# Altium schematic sheet Photodiode.SchDoc
size 420 x 297 mm; Address1: Address1; Address2: Address2; Address3: Address3; Address4: Address4; DocumentNumber: *Э3; SheetNumber: 2; SheetTotal: 11; DocumentType: Схема электрическая *
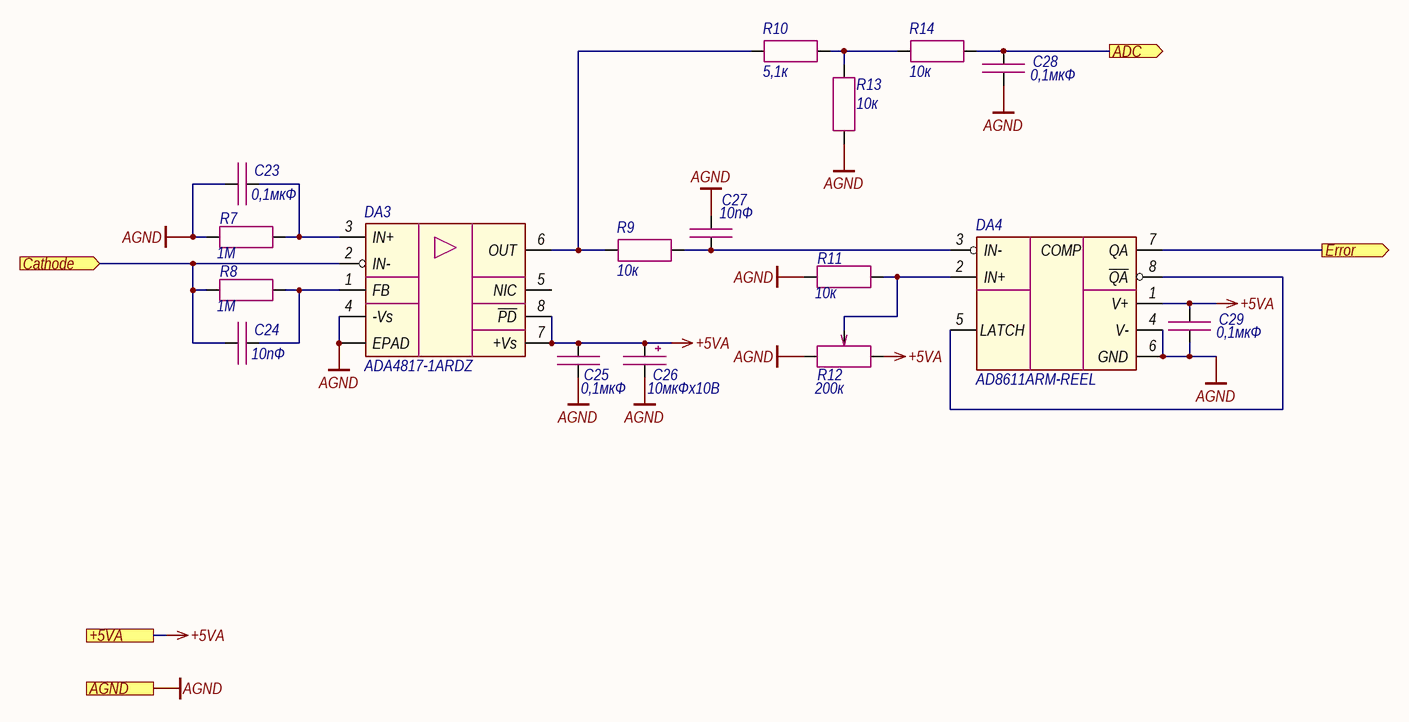
[diagram p0: Photodiode.SchDoc]

## Parts
C23  0,1мкФ  [CAP_0603]
C24  10пФ  [CAP_0603]
C25  0,1мкФ  [CAP_0603]
C26  10мкФх10B  [CAP_A]
C27  10пФ  [CAP_0603]
C28  0,1мкФ  [CAP_0603]
C29  0,1мкФ  [CAP_0603]
DA3  ADA4817-1ARDZ  [SOIC-8 EPAD]
DA4  AD8611ARM-REEL  [MSOP-8]
R7  1М  [RES_0805]
R8  1М  [RES_0805]
R9  10к  [RES_0603]
R10  5,1к  [RES_0603]
R11  10к  [RES_0603]
R12  200к  [3224W]
R13  10к  [RES_0603]
R14  10к  [RES_0603]

## Ports
+5VA (see Main[1A]), ADC (out, see Main[2A]), AGND (see Main[1A], Hardwiring[4D], LD_driver[2D], Thermistor[2C]), Cathode (in, see Main[1A]), Error (out, see Main[2A])

## Nets
+5VA: C25.1 C26.1 C29.1 DA3.7(+Vs) DA3.8(~{PD}) DA4.1(V+) R12.3 ; port +5VA
AGND: C23.1 C25.2 C26.2 C27.2 C28.2 C29.2 DA3.4(-Vs) DA3.EPAD DA4.4(V-) DA4.6(GND) R7.2 R11.1 R12.1 R13.2 ; port AGND
ADC: C28.1 R14.2 ; port ADC
Cathode: C24.2 DA3.2(IN-) R8.2 ; port Cathode
Error: DA4.7(QA) ; port Error
NetC23_2: C23.2 DA3.3(IN+) R7.1
NetC24_1: C24.1 DA3.1(FB) R8.1
NetC27_1: C27.1 DA4.3(IN-) R9.2
NetDA3_6: DA3.6(OUT) R9.1 R10.1
NetDA4_2: DA4.2(IN+) R11.2 R12.2
NetDA4_5: DA4.5(LATCH) DA4.8(~{QA})
NetR10_2: R10.2 R13.1 R14.1

Not connected (* = marked no-connect by the designer): DA3 5(NIC)

## Notes on the sheet
- Подп. и дата
- Инв. № дубл.
- Взам. инв. №
- Инв. № подл.
- Изм.
- Лист
- № докум.
- Подп.
- Дата
- Копировал
- Формат А3
- (in symbol AD8611) COMP

## Library data of the parts
C23 C25 C28 C29 = Capacitor: Manufacturer: Murata; Model: GRM188R71H104KA93D; Value: 0,1мкФ; Document: *
C24 C27 = Capacitor: Manufacturer: Murata; Model: GRM1885C1H100JA01D; Value: 10пФ; Document: *
C26 = Capacitor_Polar: Model: TECAP, 10 мкФ, 10 В, тип A, 10%; Value: 10мкФх10B; Document: *; Manufacturer: *
DA3 = ADA4817-1ARDZ: Manufacturer: Analog Devices; Model: ADA4817-1ARDZ; Document: *
DA4 = AD8611: Manufacturer: Analog Devices; Model: AD8611ARM-REEL; Document: *
R7 R8 = Resistor: Manufacturer: Yageo; Model: RC0805FR-071ML; Value: 1М; Document: *
R9 R11 R13 R14 = Resistor: Manufacturer: Yageo; Model: RC0603FR-0710KL; Value: 10к; Document: *
R10 = Resistor: Manufacturer: Yageo; Model: RC0603FR-075K1L; Value: 5,1к; Document: *
R12 = Resistor_Variable: Manufacturer: Bourns; Model: 3224W-1-204E; Value: 200к; Document: *